# Altium schematic sheet 06_Power_Supply.SchDoc
size A4; SheetNumber: 8; SheetTotal: 9
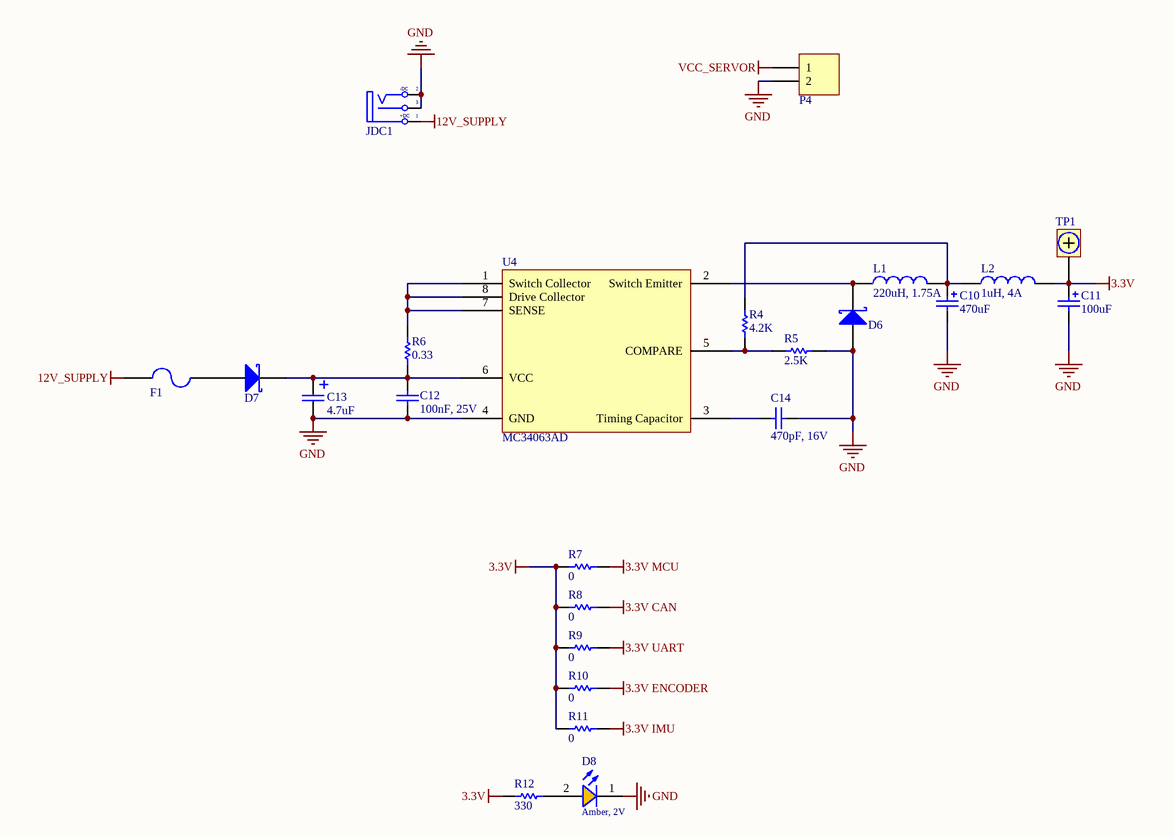
[diagram p0: 06_Power_Supply.SchDoc]

## Parts
C10  value 470uF  [CAP ALU SIZE F]  (hidden comment: Cap Pol SMD)
C11  value 100uF  [CAP ALU SIZE D]  (hidden comment: Cap Pol SMD)
C12  100nF, 25V  [WCAP-CSGP_0603_H=0.8mm_Reflow]
C13  value 4.7uF  [CAPMP3216X18N]  (hidden comment: Tantalum Capacitor)
C14  470pF, 16V  [WCAP-CSGP_0603_H=0.8mm_Reflow]
D6  D Schottky  [SS34]  (value not drawn)
D7  D Schottky  [SS34]  (value not drawn)
D8  Amber, 2V  [WL-SMCW_0603_H=0.7mm]
F1  Fuse  [FUSE SMD]  (value not drawn)
JDC1  Jack DC  [DC-IN]  (value not drawn)
L1  220uH, 1.75A  [WE-PD2A_5848]
L2  1uH, 4A  [WE-PD2A_4532]
P4  Domino 2  [DOMINO 2- 5mm]  (value not drawn)
R4  value 4.2K  [RES-SM-0603]  (hidden comment: RESISTOR SMD)
R5  value 2.5K  [RES-SM-0603]  (hidden comment: RESISTOR SMD)
R6  value 0.33  [RES-SM-0805]  (hidden comment: RESISTOR SMD)
R7  value 0  [RES-SM-0805]  (hidden comment: RESISTOR SMD)
R8  value 0  [RES-SM-0805]  (hidden comment: RESISTOR SMD)
R9  value 0  [RES-SM-0805]  (hidden comment: RESISTOR SMD)
R10  value 0  [RES-SM-0805]  (hidden comment: RESISTOR SMD)
R11  value 0  [RES-SM-0805]  (hidden comment: RESISTOR SMD)
R12  value 330  [RES-SM-0603]  (hidden comment: RESISTOR SMD)
TP1  Test point  [TP]  (value not drawn)
U4  MC34063AD  [SOIC127P600X170-8N]

## Nets
3.3V: C11.1 L2.2 R7.2 R8.2 R9.2 R10.2 R11.2 R12.2 TP1.1
3.3V CAN: R8.1
3.3V ENCODER: R10.1
3.3V IMU: R11.1
3.3V MCU: R7.1
3.3V UART: R9.1
12V_SUPPLY: F1.1 JDC1.1(T)
GND: C10.2 C11.2 C12.1 C13.2 C14.2 D6.1(A) D8.1(K) JDC1.2(TN) JDC1.3(S) P4.2 R5.1 U4.4(GND)
VCC_SERVOR: P4.1
NetC10_1: C10.1 L1.2 L2.1 R4.2
NetC12_2: C12.2 C13.1 D7.2(K) R6.1 U4.6(VCC)
NetC14_1: C14.1 U4.3(Timing_Capacitor)
NetD6_2: D6.2(K) L1.1 U4.2(Switch_Emitter)
NetD7_1: D7.1(A) F1.2
NetD8_2: D8.2(A) R12.1
NetR4_1: R4.1 R5.2 U4.5(COMPARE)
NetR6_2: R6.2 U4.1(Switch_Collector) U4.7(SENSE) U4.8(Drive_Collector)

## Notes on the sheet
- (in symbol Jack DC) -DC; +DC

## Library data of the parts
C10 C11 = Cap Pol SMD: Polarized Capacitor (Radial)
C12 = 885012206071: WCAP-CSGP Multilayer Ceramic Chip Capacitor, General Purpose, size 0603, X7R, 100nF, 25V; Manufacturer: Wurth Elektronik; Rated Voltage: 25VDC; Isolation Resistance: >=5GOhm; Capacitance Tolerance: +/-10%; Technical Reference: X7R0603104K025DFCT10000; ComponentLink1Description: Manufacturer; ComponentLink1URL: http://www.we-online.de; ComponentLink2Description: Datasheet; ComponentLink2URL: https://www.we-online.com/catalog/datasheet/885012206071.pdf; Operating Temperature: -55 to +125degC; Packaging: Tape and Reel; Manufacturer Part Number: 885012206071; Published Date: May 2020; Ceramic Type: X7R; Dissipation Factor: =<3.5%; Height: 0.8mm; Mounting Technology: SMT; Size: 0603; Capacitance: 100nF
C14 = 885012006027: WCAP-CSGP Multilayer Ceramic Chip Capacitor, General Purpose, size 0603, NP0, 470pF, 16V; Manufacturer: Wurth Elektronik; Rated Voltage: 16VDC; Isolation Resistance: >=10GOhm; Capacitance Tolerance: +/-5%; Dissipation Factor: Q>=1000; Technical Reference: NP00603471J016DFCT10000; ComponentLink1Description: Manufacturer; ComponentLink1URL: http://www.we-online.de; ComponentLink2Description: Datasheet; ComponentLink2URL: https://www.we-online.com/catalog/datasheet/885012006027.pdf; Operating Temperature: -55 to +125degC; Packaging: Tape and Reel; Manufacturer Part Number: 885012006027; Published Date: May 2020; Ceramic Type: NP0; Height: 0.8mm; Mounting Technology: SMT; Size: 0603; Capacitance: 470pF
D6 D7 = D Schottky: Schottky Diode; Published: 8-Jun-2000; LatestRevisionDate: 17-Jul-2002; LatestRevisionNote: Re-released for DXP Platform.; PackageReference: SMB; Publisher: Altium Limited; PackageDescription: DO-214-AA/SMB; 2 C-Bend Leads; Body 5.3 x 3.6 mm, inc. leads (LxW); Code_JEDEC: DO-214-AA
D8 = 150060AS75000: WL-SMCW SMT Mono-color Chip LED Waterclear, size 0603, Amber, 2V, 140deg; Chip Technology: AlInGaP; Dominant Wavelength typ.: 605nm; Luminous Intensity typ.: 130mcd; Peak Wavelength typ.: 610nm; Viewing Angle: 140deg; ComponentLink1Description: Manufacturer; ComponentLink1URL: http://www.we-online.de; ComponentLink2URL: https://www.we-online.com/catalog/datasheet/150060AS75000.pdf; ComponentLink2Description: Datasheet; Forward Voltage typ.: 2V; Emitting Color: Amber; Mounting Technology: SMT; Operating Temperature: -40 to +85degC; Published Date: December 2019; Part Number: 150060AS75000; Packaging: Tape and Reel; Size: 0603; Publisher: Wurth Elektronik
JDC1 = Jack DC: Jack DC input; Value: Jac DC
L1 = 784774222: WE-PD2A SMT Power Inductor, size 5848, 220uH, 0.41A; Manufacturer: Wurth Elektronik; DC Resistance max.: 1.57Ohm; Saturation Current: 0.47A; Self Resonant Frequency: 5MHz; DC Resistance typ.: 0.945Ohm; Rated Voltage: 80VDC; ComponentLink1Description: Manufacturer; ComponentLink1URL: http://www.we-online.de; ComponentLink2Description: Datasheet; ComponentLink2URL: https://www.we-online.com/catalog/datasheet/784774222.pdf; Manufacturer Part Number: 784774222; Published Date: May 2020; Rated Current: 0.41A; Inductance: 220uH; Operating Temperature: -40 to +125degC; Mounting Technology: SMT; Packaging: Tape and Reel; Size: 5848
L2 = 7847730: WE-PD2A SMT Power Inductor, size 4532, 1uH, 4A; Manufacturer: Wurth Elektronik; DC Resistance max.: 0.049Ohm; Saturation Current: 5.72A; Self Resonant Frequency: 110MHz; DC Resistance typ.: 0.014Ohm; Rated Voltage: 80VDC; ComponentLink1Description: Manufacturer; ComponentLink1URL: http://www.we-online.de; ComponentLink2Description: Datasheet; ComponentLink2URL: https://www.we-online.com/catalog/datasheet/7847730.pdf; Manufacturer Part Number: 7847730; Published Date: May 2020; Rated Current: 4A; Inductance: 1uH; Operating Temperature: -40 to +125degC; Mounting Technology: SMT; Packaging: Tape and Reel; Size: 4532
P4 = Domino 2: Domino, 2-Pin; LatestRevisionDate: 17-Jul-2002; LatestRevisionNote: Re-released for DXP Platform.; Publisher: Altium Limited
R4-R12 = RESISTOR SMD: Resistor
TP1 = TP: ComponentLink1Description: Supplier 1 Link
U4 = MC34063: 1.5-A boost, buck, inverting switching regulator, operation from 0°C to 70°C; Manufacturer: Texas Instruments; ComponentLink1Description: Local Supplier Link; ComponentLink1URL: https://www.thegioiic.com/products/mc34063ad-ic-dieu-chinh-tang-giam-ap-1-5a-8-soic; Local Supplier: Thegioiic; Local Supplier P/N: MC34063AD; Manufacturer P/N: MC34063AD